# EAGLE design CO2-Ampel_v11 (EAGLE 7.7.0)
Assembly variants: light

## Sheet 1 of 2
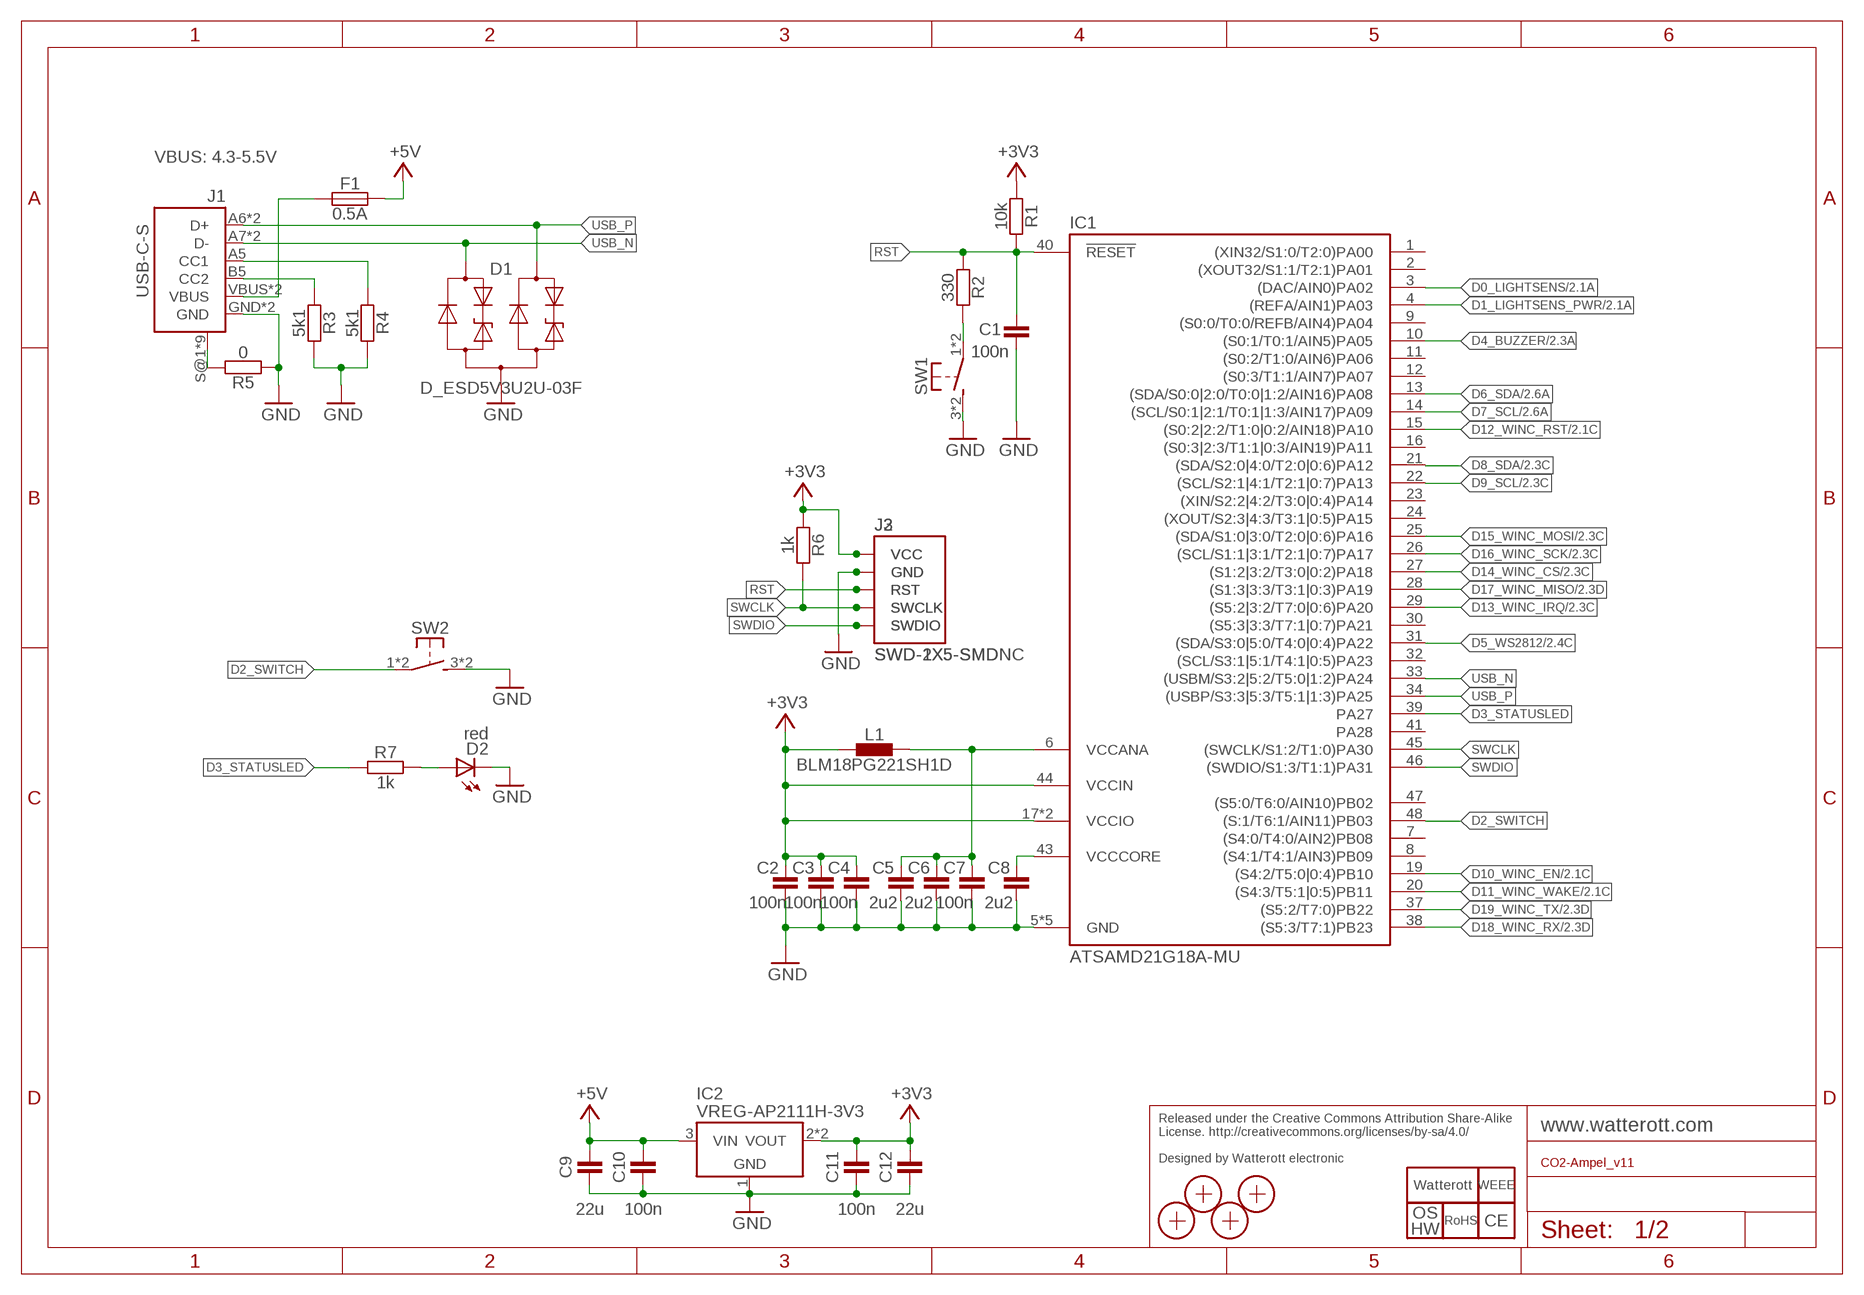
[diagram p0: schematic, sheet 1]

### Parts
C1  100n  CAPACITOR-0402  [C0402]
C2  100n  CAPACITOR-0402  [C0402]
C3  100n  CAPACITOR-0402  [C0402]
C4  100n  CAPACITOR-0402  [C0402]
C5  2u2  CAPACITOR-0402  [C0402]
C6  2u2  CAPACITOR-0402  [C0402]
C7  100n  CAPACITOR-0402  [C0402]
C8  2u2  CAPACITOR-0402  [C0402]
C9  22u  CAPACITOR-0805  [C0805]
C10  100n  CAPACITOR-0402  [C0402]
C11  100n  CAPACITOR-0402  [C0402]
C12  22u  CAPACITOR-0805  [C0805]
D1  D_ESD5V3U2U-03F  [SOT723]
D2  red  LED-0603  [C0603]
F1  0.5A  FUSE-0805  [C0805]
IC1  ATSAMD21G18A-MU  [QFN48-PAD]
IC2  VREG-AP2111H-3V3  VREG-TS1117CW-3V3  [SOT223]
J1  USB-C-S  [USB-C-S]
J2  SWD-2X5-SMD  [SWD-2X5_SMD]  (not fitted in variant light)
J3  SWD-1X5-SMDNC  [SWD-1X5_SMDNC]
L1  BLM18PG221SH1D  INDUCTOR-0603  [C0603]
LOGO1  LOGO_SPARK-4  [SPARK_4MM]
LOGO2  LOGO_WEEE-4  [WEEE_4MM]
LOGO3  OSHW_LOGOX0070  LOGO_OSHW-3  [OSHW_3MM]
LOGO4  LOGO_ROHS-4  [ROHS_4MM]
LOGO5  LOGO_CE-4  [CE_4MM]
R1  10k  RESISTOR-0402  [C0402]
R2  330  RESISTOR-0402  [C0402]
R3  5k1  RESISTOR-0402  [C0402]
R4  5k1  RESISTOR-0402  [C0402]
R5  0  RESISTOR-0603  [C0603]
R6  1k  RESISTOR-0402  [C0402]
R7  1k  RESISTOR-0402  [C0402]
SW1  PTS645SK50SMTR92-Red  SW-TACTILE-PTS840P  [PTS840P]
SW2  PTS645SH50SMTR92-Grey  SW-TACTILE-PTS840P  [PTS840P]  (not fitted in variant light)
X1  PASSER-07  [PASSER_07MM]
X2  PASSER-07  [PASSER_07MM]
X3  PASSER-07  [PASSER_07MM]
X4  PASSER-07  [PASSER_07MM]

### Nets
+3V3: C2.2 C3.2 C4.2 C11.2 C12.2 IC1.17(VCCIO) IC1.36(VCCIO) IC1.44(VCCIN) IC2.2(VOUT) IC2.4(VOUT) J2.VCC J3.1-VCC(VCC) L1.1 R1.1 R6.1 ; also sheet 2
+5V: C9.2 C10.2 F1.2 IC2.3(VIN) ; also sheet 2
CC1: J1.A5(CC1) R4.1
CC2: J1.B5(CC2) R3.1
D0_LIGHTSENS: IC1.3((DAC/AIN0)PA02) ; also sheet 2
D1_LIGHTSENS_PWR: IC1.4((REFA/AIN1)PA03) ; also sheet 2
D2_SWITCH: IC1.48((S:1/T6:1/AIN11)PB03) SW2.1 SW2.2(P1)
D3_STATUSLED: IC1.39(PA27) R7.1
D4_BUZZER: IC1.10((S0:1/T0:1/AIN5)PA05) ; also sheet 2
D5_WS2812: IC1.31((SDA/S3:0|5:0/T4:0|0:4)PA22) ; also sheet 2
D6_SDA: IC1.13((SDA/S0:0|2:0/T0:0|1:2/AIN16)PA08) ; also sheet 2
D7_SCL: IC1.14((SCL/S0:1|2:1/T0:1|1:3/AIN17)PA09) ; also sheet 2
D8_SDA: IC1.21((SDA/S2:0|4:0/T2:0|0:6)PA12) ; also sheet 2
D9_SCL: IC1.22((SCL/S2:1|4:1/T2:1|0:7)PA13) ; also sheet 2
D10_WINC_EN: IC1.19((S4:2/T5:0|0:4)PB10) ; also sheet 2
D11_WINC_WAKE: IC1.20((S4:3/T5:1|0:5)PB11) ; also sheet 2
D12_WINC_RST: IC1.15((S0:2|2:2/T1:0|0:2/AIN18)PA10) ; also sheet 2
D13_WINC_IRQ: IC1.29((S5:2|3:2/T7:0|0:6)PA20) ; also sheet 2
D14_WINC_CS: IC1.27((S1:2|3:2/T3:0|0:2)PA18) ; also sheet 2
D15_WINC_MOSI: IC1.25((SDA/S1:0|3:0/T2:0|0:6)PA16) ; also sheet 2
D16_WINC_SCK: IC1.26((SCL/S1:1|3:1/T2:1|0:7)PA17) ; also sheet 2
D17_WINC_MISO: IC1.28((S1:3|3:3/T3:1|0:3)PA19) ; also sheet 2
D18_WINC_RX: IC1.38((S5:3/T7:1)PB23) ; also sheet 2
D19_WINC_TX: IC1.37((S5:2/T7:0)PB22) ; also sheet 2
GND: C1.1 C2.1 C3.1 C4.1 C5.1 C6.1 C7.1 C8.1 C9.1 C10.1 C11.1 C12.1 D1.3(A) D2.C IC1.5(GND) IC1.18(GND) IC1.35(GND) IC1.42(GND) IC1.TP(GND) IC2.1(GND) J1.GND J1.GND2(GND) J2.GND@1(GND) J2.GND@2(GND) J2.GND@3(GND) J3.2-GND(GND) R3.2 R4.2 R5.1 SW1.3(S1) SW1.4(S1) SW2.3(S1) SW2.4(S1) ; also sheet 2
N$3: D2.A R7.2
N$8: R2.2 SW1.1 SW1.2(P1)
RST: C1.2 IC1.40(!RESET) J2.RST J3.3-RST(RST) R1.2 R2.1
SHLD: J1.S@1(SHIELD) J1.S@2(SHIELD) J1.S@3(SHIELD) J1.S@4(SHIELD) J1.S@5(SHIELD) J1.S@6(SHIELD) J1.S@7(SHIELD) J1.S@8(SHIELD) J1.S@9(SHIELD) R5.2
SWCLK: IC1.45((SWCLK/S1:2/T1:0)PA30) J2.SWCLK J3.4-SWDCLK(SWCLK) R6.2
SWDIO: IC1.46((SWDIO/S1:3/T1:1)PA31) J2.SWDIO J3.5-SWDIO(SWDIO)
USB_N [USB]: D1.1(C1) IC1.33((USBM/S3:2|5:2/T5:0|1:2)PA24) J1.A7(D-) J1.B7(D-)
USB_P [USB]: D1.2(C2) IC1.34((USBP/S3:3|5:3/T5:1|1:3)PA25) J1.A6(D+) J1.B6(D+)
VBUS: F1.1 J1.VBUS J1.VBUS2(VBUS)
VCCANA: C5.2 C6.2 C7.2 IC1.6(VCCANA) L1.2
VCCCORE: C8.2 IC1.43(VCCCORE)
Unconnected: IC1.1((XIN32/S1:0/T2:0)PA00) IC1.2((XOUT32/S1:1/T2:1)PA01) IC1.7((S4:0/T4:0/AIN2)PB08) IC1.8((S4:1/T4:1/AIN3)PB09) IC1.9((S0:0/T0:0/REFB/AIN4)PA04) IC1.11((S0:2/T1:0/AIN6)PA06) IC1.12((S0:3/T1:1/AIN7)PA07) IC1.16((S0:3|2:3/T1:1|0:3/AIN19)PA11) IC1.23((XIN/S2:2|4:2/T3:0|0:4)PA14) IC1.24((XOUT/S2:3|4:3/T3:1|0:5)PA15) IC1.30((S5:3|3:3/T7:1|0:7)PA21) IC1.32((SCL/S3:1|5:1/T4:1|0:5)PA23) IC1.41(PA28) IC1.47((S5:0/T6:0/AIN10)PB02)

### Notes on the sheet
- VBUS: 4.3-5.5V
- Released under the Creative Commons Attribution Share-Alike
  License. http://creativecommons.org/licenses/by-sa/4.0/
  
  Designed by Watterott electronic

## Sheet 2 of 2
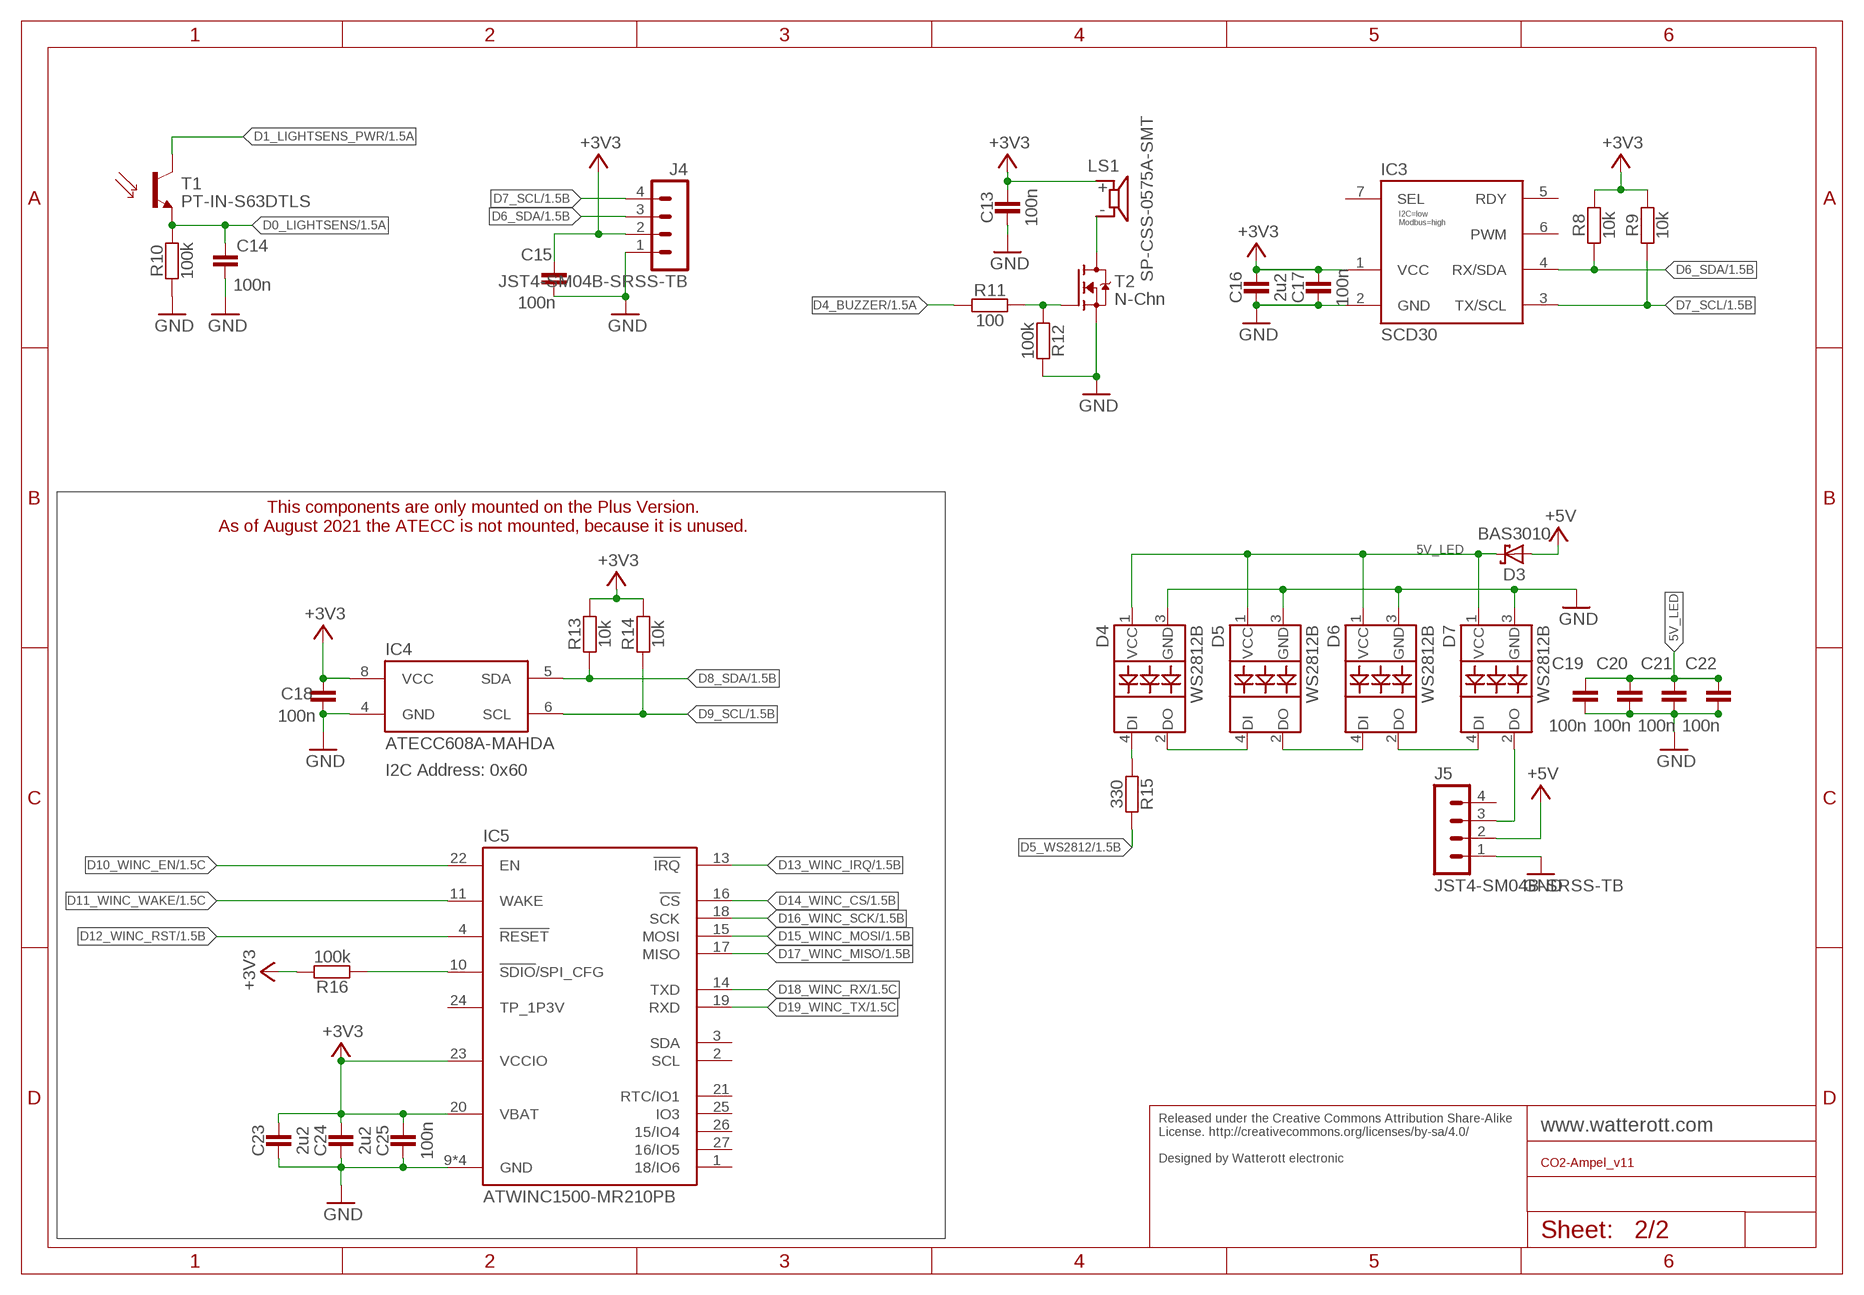
[diagram p1: schematic, sheet 2]

### Parts
C13  100n  CAPACITOR-0402  [C0402]
C14  100n  CAPACITOR-0402  [C0402]
C15  100n  CAPACITOR-0402  [C0402]
C16  2u2  CAPACITOR-0402  [C0402]
C17  100n  CAPACITOR-0402  [C0402]
C18  100n  CAPACITOR-0402  [C0402]
C19  100n  CAPACITOR-0402  [C0402]
C20  100n  CAPACITOR-0402  [C0402]
C21  100n  CAPACITOR-0402  [C0402]
C22  100n  CAPACITOR-0402  [C0402]
C23  2u2  CAPACITOR-0402  [C0402]
C24  2u2  CAPACITOR-0402  [C0402]
C25  100n  CAPACITOR-0402  [C0402]
D3  BAS3010  D_SCHOTTKY-SOD323  [SOD323]
D4  WS2812B  [WS2812B]
D5  WS2812B  [WS2812B]
D6  WS2812B  [WS2812B]
D7  WS2812B  [WS2812B]
IC3  SCD30  [SCD30]
IC4  ATECC608A-MAHDA  [UDFN8]
IC5  ATWINC1500-MR210PB  [ATWINC1500-MX210]
J4  JST4-SM04B-SRSS-TB  [JST_SM04B-SRSS-TB]
J5  JST4-SM04B-SRSS-TB  [JST_SM04B-SRSS-TB]
LS1  SP-CSS-0575A-SMT  [CUI_CSS-0575A-SMT]
R8  10k  RESISTOR-0402  [C0402]
R9  10k  RESISTOR-0402  [C0402]
R10  100k  RESISTOR-0402  [C0402]
R11  100  RESISTOR-0402  [C0402]
R12  100k  RESISTOR-0402  [C0402]
R13  10k  RESISTOR-0402  [C0402]
R14  10k  RESISTOR-0402  [C0402]
R15  330  RESISTOR-0402  [C0402]
R16  100k  RESISTOR-0402  [C0402]
T1  PT-IN-S63DTLS  [C0603T]
T2  N-Chn  MOSFET-N-SOT23  [SOT23]

### Nets
5V_LED: C19.2 C20.2 C21.2 C22.2 D3.C D4.1(VCC) D5.1(VCC) D6.1(VCC) D7.1(VCC)
+3V3: C13.2 C15.2 C16.2 C17.2 C18.2 C23.2 C24.2 C25.2 IC3.1(VCC) IC4.8(VCC) IC5.20(VBAT) IC5.23(VCCIO) J4.2 LS1.+(P) R8.2 R9.2 R13.2 R14.2 R16.2 ; also sheet 1
+5V: D3.A J5.2 ; also sheet 1
CFG: IC5.10(!SDIO!/SPI_CFG) R16.1
D0_LIGHTSENS: C14.2 R10.2 T1.E ; also sheet 1
D1_LIGHTSENS_PWR: T1.C ; also sheet 1
D4_BUZZER: R11.1 ; also sheet 1
D5_WS2812: R15.2 ; also sheet 1
D6_SDA: IC3.4(RX/SDA) J4.3 R8.1 ; also sheet 1
D7_SCL: IC3.3(TX/SCL) J4.4 R9.1 ; also sheet 1
D8_SDA: IC4.5(SDA) R13.1 ; also sheet 1
D9_SCL: IC4.6(SCL) R14.1 ; also sheet 1
D10_WINC_EN: IC5.22(EN) ; also sheet 1
D11_WINC_WAKE: IC5.11(WAKE) ; also sheet 1
D12_WINC_RST: IC5.4(!RESET) ; also sheet 1
D13_WINC_IRQ: IC5.13(!IRQ) ; also sheet 1
D14_WINC_CS: IC5.16(!CS) ; also sheet 1
D15_WINC_MOSI: IC5.15(MOSI) ; also sheet 1
D16_WINC_SCK: IC5.18(SCK) ; also sheet 1
D17_WINC_MISO: IC5.17(MISO) ; also sheet 1
D18_WINC_RX: IC5.14(TXD) ; also sheet 1
D19_WINC_TX: IC5.19(RXD) ; also sheet 1
GND: C13.1 C14.1 C15.1 C16.1 C17.1 C18.1 C19.1 C20.1 C21.1 C22.1 C23.1 C24.1 C25.1 D4.3(GND) D5.3(GND) D6.3(GND) D7.3(GND) IC3.2(GND) IC4.4(GND) IC5.9(GND) IC5.12(GND) IC5.28(GND) IC5.GND J4.1 J5.1 R10.1 R12.2 T2.2(S) ; also sheet 1
N$1: LS1.-(N) T2.3(D)
N$2: R11.2 R12.1 T2.1(G)
W1IN: D4.4(DI) R15.1
W1OUT: D4.2(DO) D5.4(DI)
W2OUT: D5.2(DO) D6.4(DI)
W3OUT: D6.2(DO) D7.4(DI)
W4OUT: D7.2(DO) J5.3
Unconnected: IC3.5(RDY) IC3.6(PWM) IC3.7(SEL) IC5.1(18/IO6) IC5.2(SCL) IC5.3(SDA) IC5.21(RTC/IO1) IC5.24(TP_1P3V) IC5.25(IO3) IC5.26(15/IO4) IC5.27(16/IO5) J5.4

### Notes on the sheet
- This components are only mounted on the Plus Version.
  As of August 2021 the ATECC is not mounted, because it is unused.
- I2C Address: 0x60
- Released under the Creative Commons Attribution Share-Alike
  License. http://creativecommons.org/licenses/by-sa/4.0/
  
  Designed by Watterott electronic

## Library data of the parts
C1-C25 = we-rcl:CAPACITOR: Capacitor ...2.2uF @ 6.3V -> 0402 ...4.7uF @ 6.3V -> 0603 ...10uF @ 16V -> 0805 ...22uF @ 25V -> 1206
D1 = we-rcl:D_ESD5V3U2U: ESD5V3U2U TVS Diode (Uni-directional Ultra Low ESD) Vrwm=5.3V, 0.4pF@1MHz; DIGIKEY: ESD5V3U2U-03F H6327DKR-ND
D2 = we-opto:LED: LED red, green, blue -> 0603
D3 = we-rcl@1:D_SCHOTTKY: Schottky Diode 1A, 30V - SOD323 (BAS3010B) 3A, 100V - SOD123 (S310A)
D4-D7 = we-opto:WS2812B: WS2812 RGB LED (built-in driver)
F1 = we-rcl:FUSE: Fuse Polyfuses 0805 - 0.5A or 1A, 6V 1206 - 2A, 6V 1812 - 1A or 2A, 16V
IC1 = we-chip:ATSAMD21G: Microchip ATSAMD21Gxx ARM Cortex-M0+ (48 pin) ...18 - 256kb Flash 32kb RAM ...17 - 128kb Flash 16kb RAM ...16 - 64kb Flash 8kb RAM ...15 - 32kb Flash 4kb RAM
IC2 = we-power:VREG: Voltage Regulator LDOs Taiwan Semi TS1117 800mA max 15V - compatible On Semi NCP1117 1A max 20V - compatible Diodes AP2111H 0.6A max 6V (0.25V@0.6A) - compatible Diodes AP2114H 1A max 6V (0.45V@1A) Taiwan Semi TS9011 250mA max 12V - compatible Diodes AP2210 300mA max 15V - compatible Microchip MCP1700 250mA max 6.5V - compatible Microchip MCP1702 250mA max 13V - compatible Microchip MCP1703 250mA max 16V - compatible Microchip MCP1754 150mA max 16V Taiwan Semi TS5204 80mA max 16V (low noise) DC/DC Converter Modules Recom R-78Ex.x-1.0-W36 1A max 28V - compatible CUI V78xx-2000 2A max 18V Murata OKI-78SR-x.x/1.5-W36 1.5A max 36V
IC3 = we-sensor:SCD30: Sensirion SCD30 CO2, Humidity, Temperature Sensor
IC4 = we-chip:ATECC608A: Microchip ATECC508A/ATECC608A Crypto-Authentication Device ATECC508A - RNG, ECC P256 (ECDH and ECDSA), SHA256 ATECC608A - RNG, ECC P256 (ECDH and ECDSA), SHA256, AES-CCM
IC5 = we-chip:ATWINC1500: Microchip ATWINC1500 WiFi/WLAN 802.11 b/g/n MR210PB - PCB antenna MR210UB - uFL connector WINC1500 - 4Mb Flash WINC1510 - 8Mb Flash
J1 = we-con:USB-C: USB-C Connector Hroparts TYPE-C-31-M-12 or Jing C167321 or XKB U262-161N-4BVC11 Up: XKB U263-241N-4BQC11-1 or Wuerth 632722110112
J2 J3 = we-board:SWD: SWD connector
J4 J5 = we-con:JST4: JST Connector
L1 = we-rcl:INDUCTOR: Inductor Ferrite Bead - Murata BLM18PG 0603 3.0A 33Ohm @ 100MH -> BLM18PG330SN1D 0603 2.0A 120Ohm @ 100MH -> BLM18PG121SN1D 0603 1.4A 220Ohm @ 100MH -> BLM18PG221SH1D 0603 1.2A 330Ohm @ 100MH -> BLM18PG331SN1D 0603 1.0A 470Ohm @ 100MH -> BLM18PG471SN1D
LOGO1 = we-symbol:LOGO_SPARK: Watterott electronic Logo
LOGO2 = we-symbol:LOGO_WEEE: WEEE Logo
LOGO3 = we-symbol:LOGO_OSHW: Open-Source-Hardware Logo
LOGO4 = we-symbol:LOGO_ROHS: RoHS Logo
LOGO5 = we-symbol:LOGO_CE: CE Logo
LS1 = we-audio:SP: Speaker/Buzzer CUI CSS-0575A-SMT (3V, 75dB); MF: CUI; MPN: CSS-0575A-SMT
R1-R16 = we-rcl:RESISTOR: Resistor all kinds in 0402 and 0603
SW1 SW2 = we-switch:SW-TACTILE: Tactile Switche; DIGIKEY: CKN10511DKR-ND
T1 = we-opto:PT: Phototransistor
T2 = we-transistor:MOSFET-N: N-Chn MOSFET SOT23 N-Chn MOSFET TSM3404, TSM240N03 (Vgs>=+/-20V, Vds<=30V, Id>=3A + Rds<=0.05Ohm @ Vgs=4.5V) BSS138 (Vgs>=+/-20V, Vds<=40V, Id>=0.2A + Rds<=3Ohm @ Vgs=4.5V) SOT223 Low Side Switch with Protection (Infineon) BSP76 (Vin=0...10V, Vds<=42V, Id=1.4A + Rds=0.2Ohm @ Vin=5V) BSP77 (Vin=0...10V, Vds<=42V, Id=2.2A + Rds=0.1Ohm @ Vin=5V) D²Pak Low Side Switch with Protection (Infineon) BTS117TC (Vin=0...10V, Vds<=60V, Id=3.5A + Rds=0.12Ohm @ Vin=5V) BTS133TC (Vin=0...10V, Vds<=60V, Id=7A + Rds=0.06Ohm @ Vin=5V) BTS141TC (Vin=0...10V, Vds<=60V, Id=12A + Rds=0.03Ohm @ Vin=5V) BTS3018TC (Vin=0...10V, Vds<=60V, Id=6A + Rds=0.02Ohm @ Vin=5V)
X1-X4 = we-symbol:PASSER: Fiducial Marker

## Net classes
1 USB: width 0.203 mm, clearance 0.152 mm

## Board
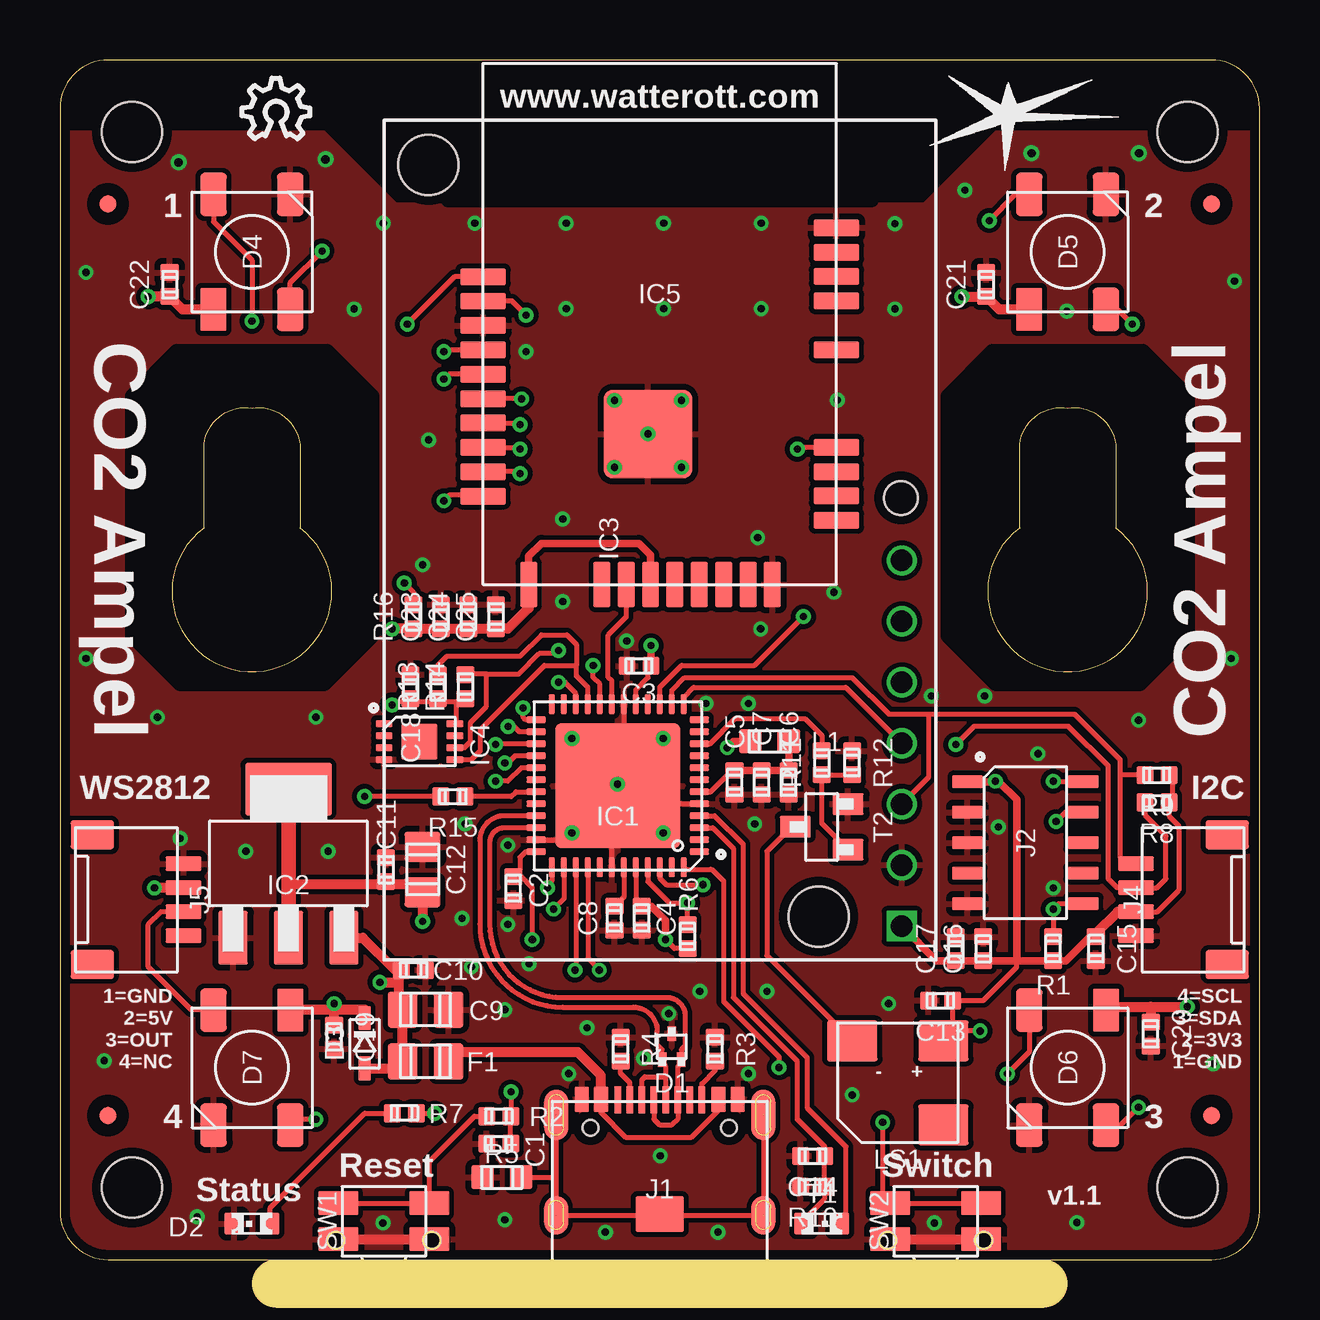
[diagram p2: board, top side]
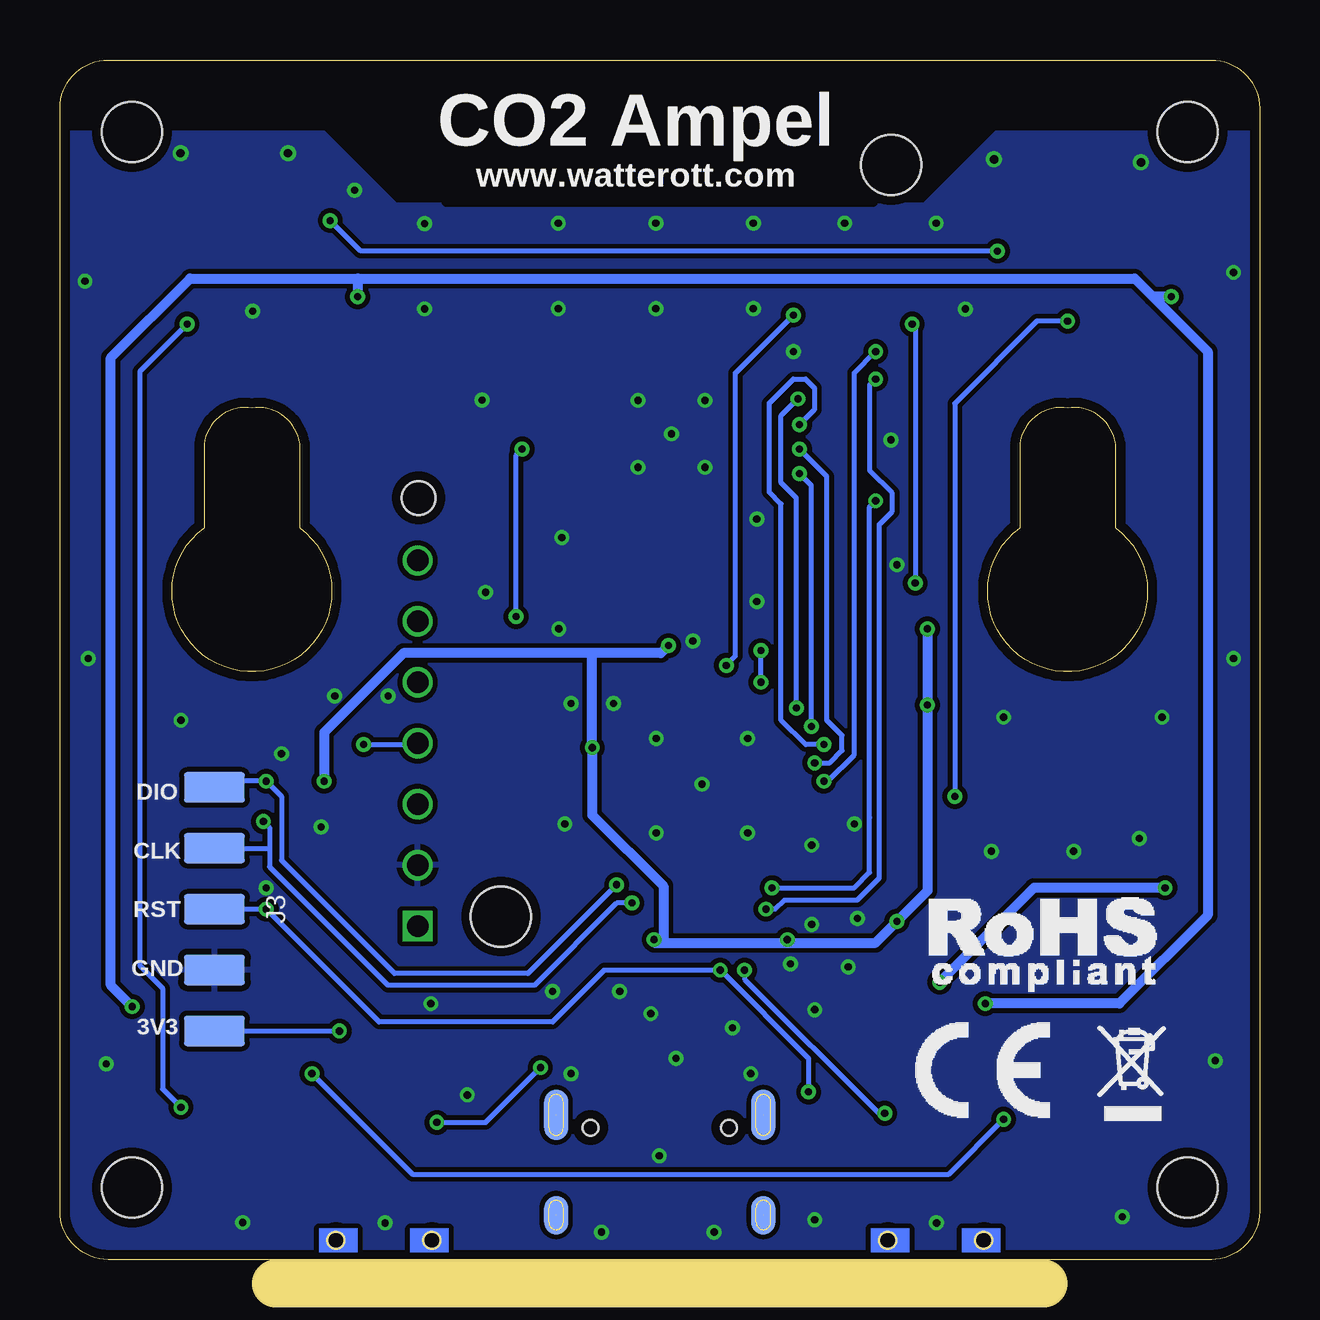
[diagram p3: board, bottom side, seen from below]

Size 50 x 50 mm. Coordinates in mm from the lower left corner, seen from the top.
Outline: 2,0 48,0 arc90 50,2 50,48 arc90 48,50 2,50 arc90 0,48 0,2 arc90 2,0
Outline: 40,30.5 40,34 arc-90 42,35.5 arc-90 44,34 44,30.5 arc-286 40,30.5
Outline: 6,30.5 6,34 arc-90 8,35.5 arc-90 10,34 10,30.5 arc-286 6,30.5
Copper layers (1*16): Top 0.035mm / dielectric 1.5mm / Bottom 0.035mm
Design rules "we-dru-2-layer *": minimum track width 0.15mm, minimum drill 0.3mm, track to track 8mil, track to pad 8mil, pad to pad 0.18mm, via to via 8mil, smd to smd 0.1mm, copper to edge 0.4mm, drill to drill 0.2mm, minimum pad ring 0.18mm, minimum via ring 0.16mm, stop-mask expansion 0.1mm, vias tented up to drill 0.5mm, thermal gap 0.25mm
Holes 2.5 mm at 3,47 3,3 47,3 47,47
Holes 1.4 mm at 35.05,31.75
tRestrict: area 3,24 to 13,37.9; area 37,24 to 47,37.9
Milling: 1 lines

### Footprints (pad centres in the part's own frame; a part is rotated, then mirrored left to right if it is on the bottom)
C0402 = smd 0.75 x 0.7: 1 0,0.5; 2 0,-0.5
C0805 = smd 1.5 x 1.25: 1 0,0.95; 2 0,-0.95
SOT723 = smd 0.6 x 0.4: 1 -0.55,0.4; 2 -0.55,-0.4; 3 0.55,0
C0603 = smd 0.9 x 0.8: A 0,-0.75; C 0,0.75
SOD323 = smd 0.5 x 1: A 0,-1.05; C 0,1.05
WS2812B = smd 1.8 x 1.1: 1 -2.4,1.6; 2 -2.4,-1.6; 3 2.4,-1.6; 4 2.4,1.6
QFN48-PAD = smd 0.8 x 0.26: 1 -3.4,2.75; 2 -3.4,2.25; 3 -3.4,1.75; 4 -3.4,1.25; 5 -3.4,0.75; 6 -3.4,0.25; 7 -3.4,-0.25; 8 -3.4,-0.75; 9 -3.4,-1.25; 10 -3.4,-1.75; 11 -3.4,-2.25; 12 -3.4,-2.75; 25 3.4,-2.75; 26 3.4,-2.25; 27 3.4,-1.75; 28 3.4,-1.25; 29 3.4,-0.75; 30 3.4,-0.25; 31 3.4,0.25; 32 3.4,0.75; 33 3.4,1.25; 34 3.4,1.75; 35 3.4,2.25; 36 3.4,2.75 | smd 0.26 x 0.8: 13 -2.75,-3.4; 14 -2.25,-3.4; 15 -1.75,-3.4; 16 -1.25,-3.4; 17 -0.75,-3.4; 18 -0.25,-3.4; 19 0.25,-3.4; 20 0.75,-3.4; 21 1.25,-3.4; 22 1.75,-3.4; 23 2.25,-3.4; 24 2.75,-3.4; 37 2.75,3.4; 38 2.25,3.4; 39 1.75,3.4; 40 1.25,3.4; 41 0.75,3.4; 42 0.25,3.4; 43 -0.25,3.4; 44 -0.75,3.4; 45 -1.25,3.4; 46 -1.75,3.4; 47 -2.25,3.4; 48 -2.75,3.4 | smd 5.2 x 5.2: TP 0,0
SOT223 = smd 2.235 x 1.219: 1 -3.099,2.311; 2 -3.099,0; 3 -3.099,-2.311 | smd 2.2 x 3.6: 4 3.099,0
SCD30 = drill 0.9 square: 1 -16.1,-10.09 | drill 0.9: 2 -13.56,-10.09; 3 -11.02,-10.09; 4 -8.48,-10.09; 5 -5.94,-10.09; 6 -3.4,-10.09; 7 -0.86,-10.09 | hole 2.5: -15.7,-6.62; 15.62,9.64
UDFN8 = smd 0.7 x 0.28: 1 -1.475,0.75; 2 -1.475,0.25; 3 -1.475,-0.25; 4 -1.475,-0.75; 5 1.475,-0.75; 6 1.475,-0.25; 7 1.475,0.25; 8 1.475,0.75 | smd 1.5 x 1.5: TP 0,0
ATWINC1500-MX210 = smd 1.9 x 0.7: 1 7.365,-8.19; 2 7.365,-7.174; 3 7.365,-6.158; 4 7.365,-5.142; 5 7.365,-1.078; 6 7.365,0.954; 7 7.365,1.97; 8 7.365,2.986; 9 7.365,4.002; 10 -7.365,1.964; 11 -7.365,0.948; 12 -7.365,-0.068; 13 -7.365,-1.084; 14 -7.365,-2.1; 15 -7.365,-3.116; 16 -7.365,-4.132; 17 -7.365,-5.148; 18 -7.365,-6.164; 19 -7.365,-7.18 | smd 0.7 x 1.9: 20 -5.465,-10.86; 21 -2.417,-10.86; 22 -1.401,-10.86; 23 -0.385,-10.86; 24 0.631,-10.86; 25 1.647,-10.86; 26 2.663,-10.86; 27 3.679,-10.86; 28 4.695,-10.86 | smd 3.7 x 3.7: GND -0.485,-4.59
USB-C-S = smd 1.1 x 0.3: A5 -1.155,-1.25; A6 -1.155,-0.25; A7 -1.155,0.25; A8 -1.155,1.25; B5 -1.155,1.75; B6 -1.155,0.75; B7 -1.155,-0.75; B8 -1.155,-1.75 | smd 1.05 x 0.6: GND -1.175,3.25; GND2 -1.175,-3.25; VBUS -1.175,2.45; VBUS2 -1.175,-2.45 | smd 2.1 x 1: S@1 -0.53,4.32; S@5 -0.53,-4.32 | smd 2.1 x 1 bottom: S@2 -0.53,4.32; S@6 -0.53,-4.32 | smd 1.6 x 1: S@3 3.65,4.32; S@7 3.65,-4.32 | smd 1.6 x 1 bottom: S@4 3.65,4.32; S@8 3.65,-4.32 | smd 1.5 x 2: S@9 3.6,0 | hole 0.65: 0,-2.89; 0,2.89
SWD-2X5_SMD = smd 1.27 x 0.533: GND@1 -2.413,1.27; GND@2 -2.413,0; GND@3 -2.413,-2.54; NC@1 -2.413,-1.27; NC@2 2.413,-1.27; RST 2.413,-2.54; SWCLK 2.413,1.27; SWDIO 2.413,2.54; SWO 2.413,0; VCC -2.413,2.54
SWD-1X5_SMDNC = smd 2.54 x 1.27: 1-VCC 0,5.08; 2-GND 0,2.54; 3-RST 0,0; 4-SWDCLK 0,-2.54; 5-SWDIO 0,-5.08
JST_SM04B-SRSS-TB = smd 1.5 x 0.6: 1 2.4,1.5; 2 2.4,0.5; 3 2.4,-0.5; 4 2.4,-1.5 | smd 1.8 x 1.2: SHLD1 -1.4,-2.7; SHLD2 -1.4,2.7
C0603' = smd 1 x 0.95: 1 0,0.8; 2 0,-0.8
CUI_CSS-0575A-SMT = smd 2.1 x 1.7: + -1.9,-1.75; - 1.9,-1.75; NC -1.9,1.75
PTS840P = smd 1.65 x 1: 1 -1.9,0.75; 2 1.9,0.75; 3 -1.9,-0.75; 4 1.9,-0.75 | hole 0.7: -2,-0.8; 2,-0.8
C0603T = smd 0.9 x 0.8: C 0,0.75; E 0,-0.75
SOT23 = smd 1.3 x 0.9: 1 -1.1,0.95; 2 -1.1,-0.95; 3 1.1,0
PASSER_07MM = smd 0.7 x 0.7: X 0,0

### Placement (x,y rotation side)
C1  18.29,4.83 90 top
C2  18.9,15.47 180 top
C3  24.14,24.75 90 top
C4  24.26,14.22 180 top
C5  28.12,19.89 180 top
C6  30.37,19.89 180 top
C7  29.24,19.89 180 top
C8  23.11,14.22 180 top
C9  15.24,10.41 270 top
C10  14.73,12.06 270 top
C11  13.59,16.26 0 top
C12  15.11,16.26 0 top
C13  36.7,10.79 90 top
C14  31.37,4.32 90 top
C15  43.18,12.95 180 top
C16  38.48,12.95 0 top
C17  37.34,12.95 0 top
C18  14.61,23.88 0 top
C19  11.43,9.27 180 top
C20  45.47,9.4 180 top
C21  38.61,40.64 0 top
C22  4.57,40.64 0 top
C23  15.88,26.8 0 top
C24  17.02,26.8 0 top
C25  18.16,26.8 0 top
D1  25.5,8.88 90 top
D2  8,1.5 90 top
D3  12.7,9.02 0 top
D4  8,42 90 top
D5  42,42 90 top
D6  42,8 270 top
D7  8,8 270 top
F1  15.24,8.26 270 top
IC1  23.25,19.75 180 top
IC2  9.53,16.51 90 top
IC3  25,30 90 top
IC4  14.99,21.59 0 top
IC5  25,39 0 top
J1  25,5.5 270 top
J2  40.24,17.37 0 top
J3  43.56,14.61 180 bottom
J4  47.25,15 180 top
J5  2.75,15 0 top
L1  BLM18PG221SH1D  [C0603']  29.58,21.6 90 top
LOGO1  39.52,47.76 0 top
LOGO2  5.35,7.78 0 bottom
LOGO3  9,48 0 top
LOGO4  9.04,13.11 0 bottom
LOGO5  11.54,7.91 0 bottom
LS1  34.92,7.37 180 top
R1  41.4,12.95 180 top
R2  18.29,5.97 270 top
R3  27.3,8.76 180 top
R4  23.37,8.76 180 top
R5  0  [C0603']  18.41,3.43 90 top
R6  26.16,13.46 180 top
R7  14.35,6.1 270 top
R8  45.72,19.05 90 top
R9  45.72,20.19 90 top
R10  31.37,3.05 90 top
R11  31.75,20.7 0 top
R12  33.02,20.7 180 top
R13  15.75,23.88 0 top
R14  16.89,23.88 0 top
R15  16.38,19.3 90 top
R16  14.73,26.8 0 top
SW1  13.5,1.6 0 top
SW2  36.5,1.6 0 top
T1  31.75,1.5 270 top
T2  31.75,18.03 180 top
X1  2,6 0 top
X2  2,44 90 top
X3  48,44 0 top
X4  48,6 0 top

### Tracks (layer width: path | path; a pad name or v marks a point on that pad's centre or on a via)
5V_LED  (via drill 0.3)
  Top 0.406: D4.1 5.11,39.6 C22.2 v3.68,40.13 | D5.1 39.15,39.6 C21.2 v37.6,40.14 v37.59,40.13 | D6.1 43.8,10.4 43.94,10.54 45.47,10.54 | 45.47,10.54 C20.2 | 45.47,10.54 v46.99,10.54 | D7.1 9.77,10.4 9.78,10.41 11.43,10.41 | C19.2 11.43,10.41 | 11.43,10.41 12.7,10.41 D3.C | v11.43,10.67 11.43,10.41
  Bottom 0.406: v46.99,10.54 47.88,11.43 47.88,37.59 44.58,40.89 37.59,40.89 | 37.59,40.89 v37.59,40.13 | v3.68,40.13 4.45,40.13 | 4.45,40.13 5.21,40.89 37.59,40.89 | 4.45,40.13 2.16,37.85 2.16,14.35 5.84,10.67 v11.43,10.67
+3V3  (via drill 0.3)
  Top 0.203: IC1.44 24,14.98 C4.2 | v19.68,13.34 19.68,15.49 19.18,16 18.94,16 C2.2 19.18,16.24 19.18,16.76 19.41,17 IC1.36 | R6.1 25.61,12.96 v25.23,13.34 | IC1.17 24,23.75 24.51,24.26 24.51,24.63 C3.2 | C16.2 | R1.1 | 39.88,12.45 39.88,12.19 38.48,10.79 C13.2 37.2,9.49 LS1.+ 37.23,9.53 v38.35,9.53 | v38.99,19.94 38.96,19.91 39.14,19.91 | R9.2 46.35,20.19 46.35,19.18 R8.2 46.22,18.49 46.63,18.07 46.63,15.39 45.74,14.5 J4.2 | 16.51,23.24 16.51,22.39 IC4.8 | 16.51,23.24 16.89,23.24 R14.2 | 16.51,23.24 15.75,23.24 | 15.75,23.24 14.61,23.24 | 14.61,23.24 C18.2 | R13.2 15.75,23.24 | 14.61,23.24 13.97,23.24 v13.84,23.11 | 9.53,15.63 9.53,15.62
  Top 0.305: v25.23,13.34 25.23,14.13 24.65,14.72 C4.2 | L1.1 28.08,21.6 v27.81,21.34 | IC5.20 19.54,29.31 20.07,29.84 24.13,29.84 24.61,29.36 IC5.23 | v24.64,25.59 C3.2 | 39.88,12.45 39.88,19.18 39.14,19.91 | 39.88,12.45 C16.2 | R1.1 39.88,12.45 | R1.1 41.92,12.45 42.92,13.45 C15.2 | C16.2 C17.2 36.54,12.45 IC3.1 | J2.VCC 38.96,19.91
  Top 0.406: C11.2 13.59,15.63 | 13.59,15.63 9.53,15.63 | 13.59,15.63 15.11,15.63 C12.2 v15.11,14.1 | IC5.20 19.54,27.16 18.68,26.3 C25.2 C24.2 C23.2 R16.2 13.85,26.3 v13.84,26.29 | J4.2 44.09,14.5 43.18,13.59 C15.2
  Top 0.61: 9.53,15.62 IC2.2 | 9.53,15.63 IC2.4
  Bottom 0.203: v27.81,21.34 v27.82,21.33 | J3.1-VCC v38.35,9.53
  Bottom 0.406: 24.85,13.21 19.68,13.21 | v25.23,13.34 25.23,13.21 24.85,13.21 | v19.68,13.34 19.68,13.21 | 19.68,13.21 16,13.21 v15.11,14.1 13.84,15.37 v13.84,23.11 v13.84,26.29 | 24.85,13.21 24.85,15.57 27.82,18.53 v27.82,21.33 | v24.64,25.59 24.96,25.27 27.81,25.27 | v38.99,19.94 38.99,21.97 35.69,25.27 27.81,25.27 | v27.81,21.34 27.81,25.27
+5V  (via drill 0.3)
  Top 0.203: C9.2 14.1,10.41 14.11,10.42
  Top 0.406: C9.2 F1.2 14,7.97 D3.A | 14.11,12.06 14.11,11.56 | 14.11,11.56 14.11,10.42 | IC2.3 12.62,13.41 13.97,12.06 14.11,12.06 | 14.11,12.06 C10.2 | J5.2 v3.94,15.49 | v13.34,11.56 14.11,11.56
  Bottom 0.406: v13.34,11.56 9.4,15.49 v3.94,15.49
CC1
  Top 0.203: J1.A5 23.75,7.37 23.37,7.75 R4.1
CC2
  Top 0.203: J1.B5 26.75,7.33 27.3,7.88 R3.1
CFG  (via drill 0.3)
  Top 0.203: IC5.10 16.45,40.96 v14.48,38.99 | v14.35,28.19 14.73,27.81 R16.1
  Bottom 0.203: v14.48,38.99 14.35,38.86 v14.35,28.19
D0_LIGHTSENS
  Top 0.203: IC1.3 27.21,18 28.07,17.14 28.07,10.92 30.73,8.26 30.73,5.84 31.88,4.7 31.88,4.57 31.87,4.56 C14.2 R10.2 31.88,2.54 31,1.66 T1.E
D1_LIGHTSENS_PWR
  Top 0.203: IC1.4 27.29,18.5 28.47,17.31 28.47,11.09 31.14,8.42 31.14,6.33 32.77,4.7 32.77,1.52 32.52,1.52 T1.C
D2_SWITCH  (via drill 0.3)
  Top 0.203: SW2.2 SW2.1 34.29,2.66 v34.29,5.71 | IC1.48 26.09,16.26 27.13,16.26 27.18,16.26 27.66,15.77 27.66,10.75 29.97,8.44 v29.97,8
  Bottom 0.203: v34.29,5.71 32.26,5.71 v29.97,8
D3_STATUSLED  (via drill 0.3)
  Top 0.203: R7.1 v15.62,6.1 | IC1.39 21.5,12.1 v21.46,12.06
  Bottom 0.203: v21.46,12.06 21.46,11.68 15.88,6.1 v15.62,6.1
D4_BUZZER
  Top 0.203: IC1.10 27.09,21.5 28.13,22.54 31.05,22.54 31.75,21.84 R11.1
D5_WS2812
  Top 0.203: R15.2 18.81,19.3 19.01,19.5 IC1.31
D6_SDA  (via drill 0.3)
  Top 0.203: IC1.13 26,23.43 26.42,23.85 32.76,23.85 IC3.4 | v37.34,21.46 38.1,22.23 42.04,22.23 43.69,20.57 43.69,15.88 44.06,15.5 J4.3 45.46,15.5 45.47,15.49 45.72,15.49 46.1,15.88 46.1,17.65 45.22,18.53 R8.1
  Bottom 0.203: v37.34,21.46 35.15,21.46 IC3.4
D7_SCL
  Top 0.203: IC1.14 25.5,23.72 26.04,24.26 33.02,24.26 34.54,22.73 36.2,22.73 | 36.2,22.73 36.2,20.09 IC3.3 | 36.2,22.73 42.29,22.73 44.2,20.83 44.2,20.19 | 44.2,20.19 44.2,16.76 44.46,16.5 J4.4 | R9.1 44.2,20.19
D8_SDA
  Top 0.203: IC1.21 22,23.85 21.53,24.32 21.53,24.77 | 21.53,24.77 20.19,24.77 17.53,22.1 17.53,21.21 17.16,20.84 IC4.5 | R13.1 15.75,24.77 16.13,25.15 19.18,25.15 20.07,26.04 21.13,26.04 21.53,25.64 21.53,24.77
D9_SCL  (via drill 0.3)
  Top 0.203: IC1.22 21.5,23.59 21.23,23.86 21.02,24.06 v20.79,24.06 | IC4.6 16.87,21.34 17.12,21.59 17.12,22.39 17.78,23.05 17.78,24.41 | v20.79,25.38 20.66,25.25 19.98,25.25 19.14,24.41 17.78,24.41 | R14.1 16.93,24.41 17.78,24.41
  Bottom 0.203: v20.79,24.06 v20.79,25.38
D10_WINC_EN
  Top 0.203: IC1.19 23,24.12 22.85,24.26 22.85,26.03 23.6,26.77 IC5.22
D11_WINC_WAKE  (via drill 0.3)
  Top 0.203: v19.43,39.37 18.85,39.95 IC5.11 | IC1.20 22.5,23.98 22.23,24.26 v22.23,24.77
  Bottom 0.203: v19.43,39.37 21.84,36.96 21.84,25.15 v22.23,24.77
D12_WINC_RST  (via drill 0.3)
  Top 0.203: v30.73,33.78 30.81,33.86 IC5.4 | v30.99,26.8 28.96,24.77 25.91,24.77 25,23.86 IC1.15
  Bottom 0.203: v30.99,26.8 30.99,33.53 v30.73,33.78
D13_WINC_IRQ  (via drill 0.3)
  Top 0.203: v16,37.85 16.07,37.92 IC5.13 | IC1.29 19.23,20.5 18.67,19.94 v18.16,19.94
  Bottom 0.203: v18.16,19.94 17.99,19.94 16.89,21.04 16.89,36.96 v16,37.85
D14_WINC_CS  (via drill 0.3)
  Top 0.203: v19.18,34.8 19.11,34.87 IC5.16 | IC1.27 18.2,21.5 v18.16,21.46
  Bottom 0.203: v19.18,34.8 18.54,35.43 18.54,36.32 18.92,36.7 19.43,36.7 20.45,35.69 20.45,32 19.94,31.5 19.94,22.48 18.92,21.46 v18.16,21.46
D15_WINC_MOSI  (via drill 0.3)
  Top 0.203: v19.24,35.88 17.64,35.88 IC5.15 | IC1.25 19.41,22.5 19.3,22.61 v19.3,22.99
  Bottom 0.203: v19.24,35.88 19.94,35.18 19.94,32.38 19.3,31.75 v19.3,22.99
D16_WINC_SCK  (via drill 0.3)
  Top 0.203: v19.18,32.77 19.11,32.84 IC5.18 | IC1.26 19.15,22 18.93,22.22 v18.68,22.22
  Bottom 0.203: v18.68,22.22 18.68,32.27 v19.18,32.77
D17_WINC_MISO  (via drill 0.3)
  Top 0.203: IC5.17 19.11,33.85 v19.18,33.78 | IC1.28 18.97,21 18.67,20.7 v18.54,20.7
  Bottom 0.203: v19.18,33.78 18.03,32.64 18.03,22.48 17.4,21.84 17.4,21.21 17.91,20.7 v18.54,20.7
D18_WINC_RX  (via drill 0.3)
  Top 0.203: IC5.14 16.2,36.9 v16,36.7 | IC1.38 21,15.03 v20.57,14.61
  Bottom 0.203: v16,36.7 16.26,36.45 16.26,32.89 15.3,31.94 15.3,31.18 15.85,30.64 15.85,15.9 16.76,14.99 19.81,14.99 20.19,14.61 v20.57,14.61
D19_WINC_TX  (via drill 0.3)
  Top 0.203: v16,31.62 16.26,31.88 17.58,31.88 IC5.19 | IC1.37 20.5,15.8 20.32,15.62 v20.32,15.49
  Bottom 0.203: v20.32,15.49 16.89,15.49 16.25,16.13 16.25,18.43 16.26,18.43 16.26,31.37 v16,31.62
GND  (via drill 0.3, 0.35)
  Top 0.203: IC1.42 23,17.5 | IC1.5 25.58,19 25.53,19.05 | IC1.18 23.5,22.1 | v23.24,19.81 IC1.TP | IC1.35 20.85,17.5 20.95,17.4
  Top 0.406: SW1.3 SW1.4 | SW2.3 SW2.4
  other vias: 21.97,9.65 25.38,10.25 33.02,6.86 32.26,27.81 29.21,26.29 48.07,8.16 48.83,25.05 48.96,40.78 44.97,46.11 40.5,46.11 11.07,45.86 4.94,45.73 1.08,41.15 1.08,25.05 1.84,8.29 42.38,1.54 10.67,22.61 23.11,35.81 25.91,35.81 25.91,33.02 23.11,33.02 24.51,34.42 34.8,43.18 37.72,44.58 19.43,37.85 13.46,1.52 36.45,1.52 28.7,7.75 21.21,7.75 44.96,22.48 4.06,22.61 41.97,39.53 12.26,39.62 13.48,43.19 17.29,43.19 21.1,43.19 25.16,43.19 29.23,43.19 5.01,17.56 25.02,4.32 18.54,1.65 27.43,1.14 5.71,1.78 18.67,17.27 25.16,39.64 29.23,39.64 21.1,39.64 34.8,39.62 16.89,18.16 32.4,35.83 36.32,23.5 16.76,14.22 18.67,13.97 17.14,12.19 19.56,12.32 18.54,10.41 26.67,11.18 29.46,11.18 34.54,10.67 28.96,18.16 21.34,17.78 25.15,17.78 21.34,21.72 25.15,21.72 38.54,23.5 20.95,27.43 29.08,30.1 20.95,30.86 15.37,34.16 26.92,23.18 28.7,23.18 24.32,8.38 39.12,18.03 40.77,21.08 15.11,28.96 23.62,25.78 11.18,17.02 7.75,17.02 41.4,15.49 22.73,1.14
  pour Top (isolate 0.203): 0,0 50,0 50,47 39,47 36,44 14,44 11,47 0,47
  pour Bottom (isolate 0.203): 0,0 50,0 50,47 39,47 36,44 14,44 11,47 0,47
N$1
  Top 0.203: T2.3 30.48,18.03 29.46,17.02 29.46,12.68 LS1.-
N$2
  Top 0.203: T2.1 31.75,18.18 R11.2 R12.1
N$3
  Top 0.203: D2.A 8.76,1.51 8.76,2.16 12.7,6.1 R7.2
N$8
  Top 0.203: SW1.1 SW1.2 15.4,4.1 17.27,5.97 R2.2
RST  (via drill 0.3)
  Top 0.203: C1.2 R2.1 v18.8,6.99 | IC1.40 22,12.54 v22.48,12.06 | J2.RST 41.63,14.83 v41.4,14.61 R1.2
  Bottom 0.203: v18.8,6.99 18.8,8.38 v22.48,12.06 27.3,12.06 29.46,9.91 36.7,9.91 v41.4,14.61 J3.3-RST
SHLD  (4 unrouted)
  Top 0.203: J1.S@6 20.68,3.43 | 20.68,3.43 J1.S@7 25.02,1.85 | J1.S@1 J1.S@3 25.02,1.85 | R5.2 20.68,3.43 | J1.S@9 25.02,1.88 25.02,1.85
SWCLK  (via drill 0.3)
  Top 0.203: J2.SWCLK 41.9,18.64 v41.52,18.26 | IC1.45 24.5,15.76 25.4,14.86 v26.16,14.86 R6.2
  Bottom 0.203: v26.16,14.86 26.8,14.86 30.23,11.43 36.32,11.43 41.27,16.38 41.27,17.14 | v41.52,18.26 41.27,18 41.27,17.14 | J3.4-SWDCLK 41.27,17.14
SWDIO  (via drill 0.3)
  Top 0.203: J2.SWDIO 41.43,19.91 v41.4,19.94 | IC1.46 25,15.89 25.27,15.62 v26.8,15.62
  Bottom 0.203: v26.8,15.62 30.49,11.93 36.05,11.93 40.77,16.64 40.77,19.3 v41.4,19.94 43.31,19.94 J3.5-SWDIO
USB_N
  Top 0.203: J1.A7 25.25,7.62 | 25.25,7.62 25.25,8.04 25.1,8.19 D1.1 25.1,8.74 24.89,8.95 24.89,9.53 arc90 23.9,10.52 20.95,10.52 arc-90 17.5,13.97 17.5,17.46 arc-90 18.54,18.5 IC1.33 | 25.25,7.62 24.38,7.62 24.25,7.49 J1.B7
USB_P
  Top 0.203: J1.A6 24.75,5.85 24.98,5.62 25.52,5.62 25.75,5.85 J1.B6 25.75,8.04 25.9,8.19 D1.2 25.9,8.76 26.06,8.91 26.06,10.16 arc90 25.3,10.92 20.95,10.92 arc-90 17.91,13.97 17.91,17.37 arc-90 18.54,18 IC1.34
VBUS
  Top 0.203: J1.VBUS2 22.55,6.13 23.6,5.08 26.3,5.08 27.45,6.23 J1.VBUS
  Top 0.406: J1.VBUS2 22.55,7.68 21.59,8.64 16.57,8.64 F1.1
VCCANA
  Top 0.203: C6.2 | IC1.6 27.12,19.5 28,20.39 C5.2
  Top 0.305: C5.2 C7.2 C6.2 | L1.2 C6.2
VCCCORE
  Top 0.203: IC1.43 23.5,15.11 C8.2
W1IN  (via drill 0.3)
  Top 0.203: R15.1 v12.7,19.3 | v8,39.12 8,41.66 6.4,43.26 D4.4
  Bottom 0.203: v8,39.12 9.27,39.12 12.7,35.69 v12.7,19.3
W1OUT  (via drill 0.3)
  Top 0.203: D4.2 9.6,40.72 v10.92,42.04 | v38.73,43.31 39.83,44.4 D5.4
  Bottom 0.203: v38.73,43.31 37.47,42.04 v10.92,42.04
W2OUT  (via drill 0.3)
  Top 0.203: D5.2 44.09,39.6 v44.7,38.99 | v44.96,6.35 44.21,5.6 D6.4
  Bottom 0.203: v44.7,38.99 46.67,37.02 46.67,12.26 45.72,11.3 45.72,7.11 v44.96,6.35
W3OUT  (via drill 0.3)
  Top 0.203: D6.2 40.4,8.65 v39.5,7.75 | v10.67,5.84 9.78,5.84 9.6,5.66 D7.4
  Bottom 0.203: v39.5,7.75 35.31,3.56 12.95,3.56 v10.67,5.84
W4OUT
  Top 0.203: D7.2 6.39,10.41 5.46,10.41 3.68,12.19 3.68,13.97 4.21,14.5 J5.3

### Text on the board
tPlace: www.watterott.com | 1 | 2 | CO2 Ampel | CO2 Ampel | WS2812 | I2C | 1=GND / 2=5V / 3=OUT / 4=NC | 4=SCL / 3=SDA / 2=3V3 / 1=GND | 4 | 3 | Reset | Switch | Status | v1.1
bPlace: CO2 Ampel | www.watterott.com | DIO / CLK / RST / GND / 3V3
Reference: Silkscreen: 21 tPlace + 22 bPlace